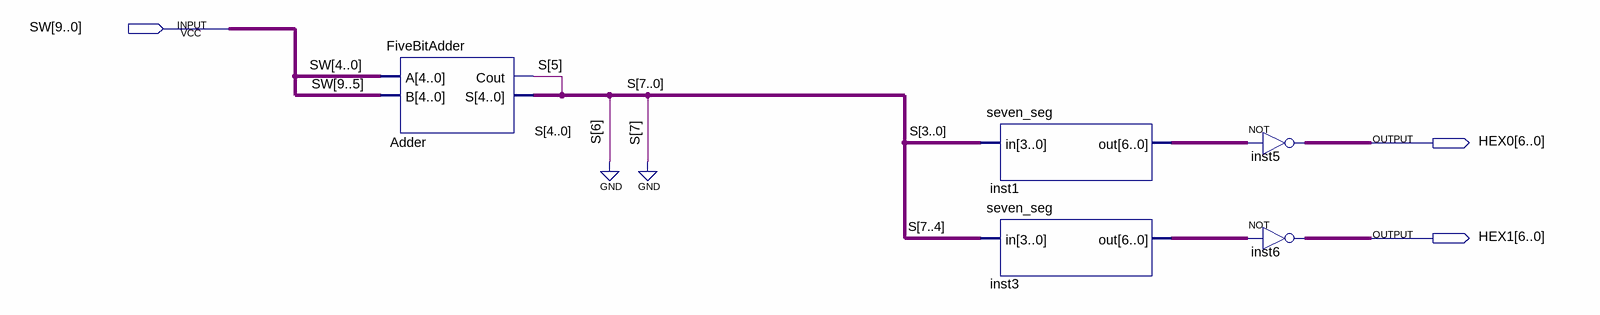
[diagram p0: schematic sheet]
// Quartus schematic Lab_4a_Schematic.bdf as structural Verilog: 5 symbols, 3 pins
module Lab_4a_Schematic (
  input  [9:0] SW,
  output [6:0] HEX0,
  output [6:0] HEX1
);

  wire [5:0] S;
  wire [6:0] inst1_out, inst3_out;

  FiveBitAdder Adder (.A(SW[4:0]), .B(SW[9:5]), .Cout(S[5]), .S(S[4:0]));
  seven_seg inst1 (.in(S[3:0]), .out(inst1_out));
  seven_seg inst3 (.in({2'b00, S[5:4]}), .out(inst3_out));
  assign HEX0 = ~inst1_out;  // NOT inst5, 7 bits wide
  assign HEX1 = ~inst3_out;  // NOT inst6, 7 bits wide
endmodule
